# EAGLE schematic BMSV1.1 (EAGLE 9.2.2)

## Sheet 1 of 3
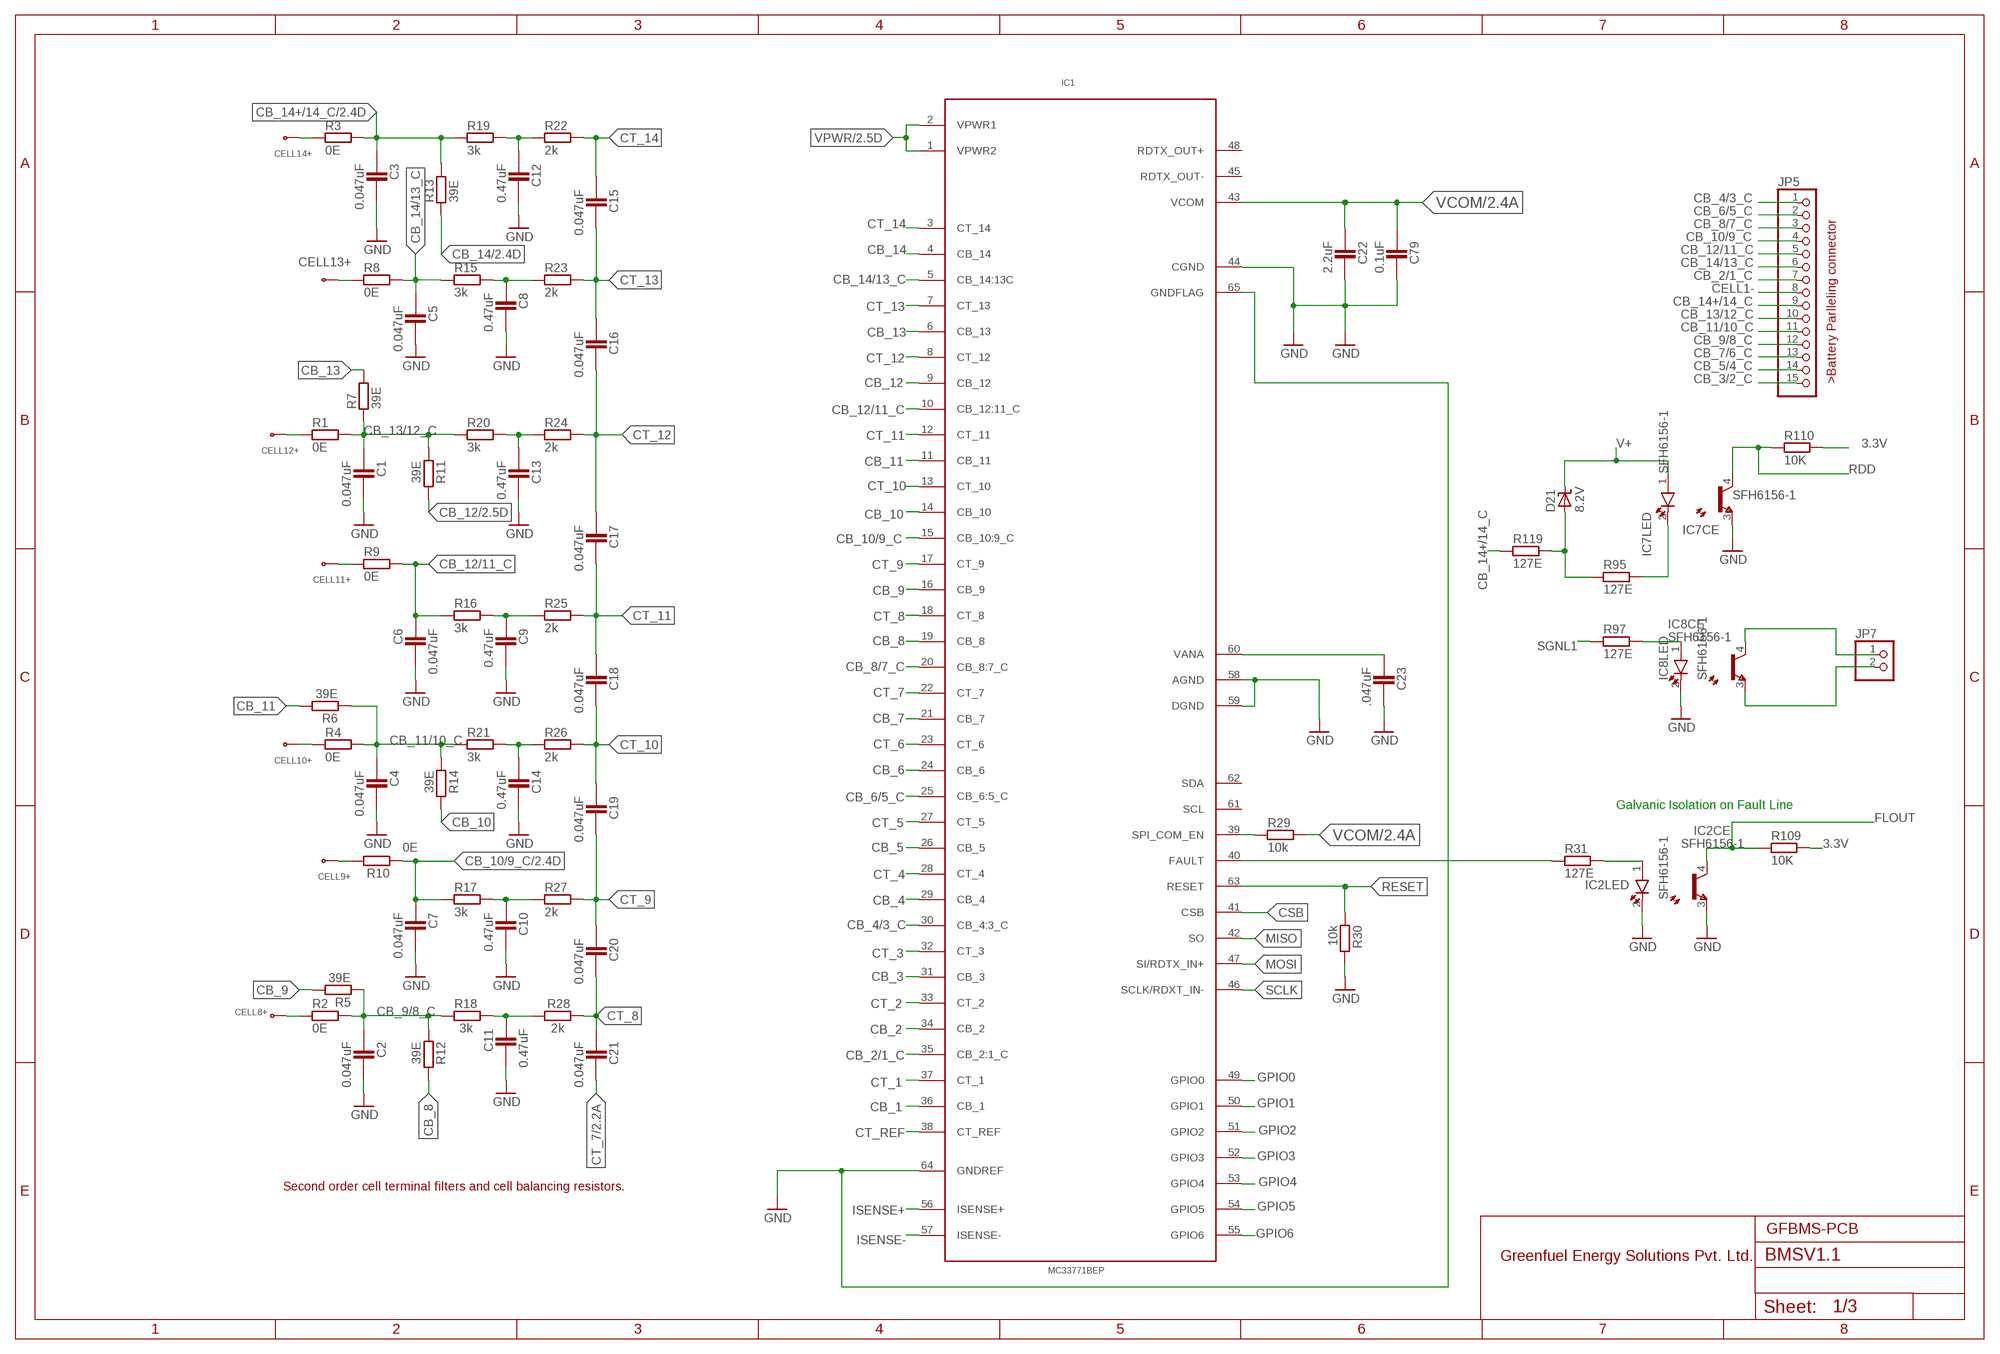
[diagram p0: schematic, sheet 1]

### Parts
C1  0.047uF  CAPACITOR_0603  [CAPC1608X92N]
C2  0.047uF  CAPACITOR_0603  [CAPC1608X92N]
C3  0.047uF  CAPACITOR_0603  [CAPC1608X92N]
C4  0.047uF  CAPACITOR_0603  [CAPC1608X92N]
C5  0.047uF  CAPACITOR_0603  [CAPC1608X92N]
C6  0.047uF  CAPACITOR_0603  [CAPC1608X92N]
C7  0.047uF  CAPACITOR_0603  [CAPC1608X92N]
C8  0.47uF  CAPACITOR_1206  [CAPC3215X168N]
C9  0.47uF  CAPACITOR_1206  [CAPC3215X168N]
C10  0.47uF  CAPACITOR_1206  [CAPC3215X168N]
C11  0.47uF  CAPACITOR_1206  [CAPC3215X168N]
C12  0.47uF  CAPACITOR_1206  [CAPC3215X168N]
C13  0.47uF  CAPACITOR_1206  [CAPC3215X168N]
C14  0.47uF  CAPACITOR_1206  [CAPC3215X168N]
C15  0.047uF  CAPACITOR_0402  [CAPC1005X60N]
C16  0.047uF  CAPACITOR_0402  [CAPC1005X60N]
C17  0.047uF  CAPACITOR_0402  [CAPC1005X60N]
C18  0.047uF  CAPACITOR_0402  [CAPC1005X60N]
C19  0.047uF  CAPACITOR_0402  [CAPC1005X60N]
C20  0.047uF  CAPACITOR_0402  [CAPC1005X60N]
C21  0.047uF  CAPACITOR_0402  [CAPC1005X60N]
C22  2.2uF  CAPACITOR_0603  [CAPC1608X92N]
C23  .047uF  CAPACITOR_0402  [CAPC1005X60N]
C79  0.1uF  CAPACITOR_0603  [CAPC1608X92N]
CELL8+  GF_BMS_CELL_PADP_PAD  [CELL_PAD]
CELL9+  GF_BMS_CELL_PADP_PAD  [CELL_PAD]
CELL10+  GF_BMS_CELL_PADP_PAD  [CELL_PAD]
CELL11+  GF_BMS_CELL_PADP_PAD  [CELL_PAD]
CELL12+  GF_BMS_CELL_PADP_PAD  [CELL_PAD]
CELL13+  GF_BMS_CELL_PADP_PAD  [CELL_PAD]
CELL14+  GF_BMS_CELL_PADP_PAD  [CELL_PAD]
D21  8.2V  ZENER_SOD-123  [SOD3718X135N]
IC1  MC33771BEP  [64PIN-LQFP]
IC2  SFH6156-1  SFH6156  [SFH]
IC7  SFH6156-1  SFH6156  [SFH]
IC8  SFH6156-1  SFH6156  [SFH]
JP5  PINHD-1X15  [1X15]
JP7  PINHD-1X2  [1X02]
R1  0E  RESISTOR_0402  [RESC1005X40AN]
R2  0E  RESISTOR_0402  [RESC1005X40AN]
R3  0E  RESISTOR_0402  [RESC1005X40AN]
R4  0E  RESISTOR_0402  [RESC1005X40AN]
R5  39E  RESISTOR_1210  [RESC3225X70N]
R6  39E  RESISTOR_1210  [RESC3225X70N]
R7  39E  RESISTOR_1210  [RESC3225X70N]
R8  0E  RESISTOR_0402  [RESC1005X40AN]
R9  0E  RESISTOR_0402  [RESC1005X40AN]
R10  0E  RESISTOR_0402  [RESC1005X40AN]
R11  39E  RESISTOR_1210  [RESC3225X70N]
R12  39E  RESISTOR_1210  [RESC3225X70N]
R13  39E  RESISTOR_1210  [RESC3225X70N]
R14  39E  RESISTOR_1210  [RESC3225X70N]
R15  3k  RESISTOR_0402  [RESC1005X40AN]
R16  3k  RESISTOR_0402  [RESC1005X40AN]
R17  3k  RESISTOR_0402  [RESC1005X40AN]
R18  3k  RESISTOR_0402  [RESC1005X40AN]
R19  3k  RESISTOR_0402  [RESC1005X40AN]
R20  3k  RESISTOR_0402  [RESC1005X40AN]
R21  3k  RESISTOR_0402  [RESC1005X40AN]
R22  2k  RESISTOR_0402  [RESC1005X40AN]
R23  2k  RESISTOR_0402  [RESC1005X40AN]
R24  2k  RESISTOR_0402  [RESC1005X40AN]
R25  2k  RESISTOR_0402  [RESC1005X40AN]
R26  2k  RESISTOR_0402  [RESC1005X40AN]
R27  2k  RESISTOR_0402  [RESC1005X40AN]
R28  2k  RESISTOR_0402  [RESC1005X40AN]
R29  10k  RESISTOR_0402  [RESC1005X40AN]
R30  10k  RESISTOR_0402  [RESC1005X40AN]
R31  127E  RESISTOR_0603  [RESC1608X55N]
R95  127E  RESISTOR_0603  [RESC1608X55N]
R97  127E  RESISTOR_0603  [RESC1608X55N]
R109  10K  RESISTOR_0402  [RESC1005X40AN]
R110  10K  RESISTOR_0402  [RESC1005X40AN]
R119  127E  RESISTOR_0603  [RESC1608X55N]

### Nets
3.3V: R109.2 R110.2 ; also sheet 3
CB_1: IC1.36(CB_1) ; also sheet 2
CB_2: IC1.34(CB_2) ; also sheet 2
CB_2/1_C: IC1.35(CB_2:1_C) JP5.7 ; also sheet 2
CB_3: IC1.31(CB_3) ; also sheet 2
CB_3/2_C: JP5.15 ; also sheet 2
CB_4: IC1.29(CB_4) ; also sheet 2
CB_4/3_C: IC1.30(CB_4:3_C) JP5.1 ; also sheet 2
CB_5: IC1.26(CB_5) ; also sheet 2
CB_5/4_C: JP5.14 ; also sheet 2
CB_6: IC1.24(CB_6) ; also sheet 2
CB_6/5_C: IC1.25(CB_6:5_C) JP5.2 ; also sheet 2
CB_7: IC1.21(CB_7) ; also sheet 2
CB_7/6_C: JP5.13 ; also sheet 2
CB_8: IC1.19(CB_8) R12.2
CB_8/7_C: IC1.20(CB_8:7_C) JP5.3 ; also sheet 2
CB_9: IC1.16(CB_9) R5.2
CB_9/8_C: C2.1 JP5.12 R2.2 R5.1 R12.1 R18.1
CB_10: IC1.14(CB_10) R14.2
CB_10/9_C: C7.1 IC1.15(CB_10:9_C) JP5.4 R10.1 R17.1 ; also sheet 2
CB_11: IC1.11(CB_11) R6.2
CB_11/10_C: C4.1 JP5.11 R4.2 R6.1 R14.1 R21.1
CB_12: IC1.9(CB_12) R11.2 ; also sheet 2
CB_12/11_C: C6.1 IC1.10(CB_12:11_C) JP5.5 R9.2 R16.1
CB_13: IC1.6(CB_13) R7.2
CB_13/12_C: C1.1 JP5.10 R1.2 R7.1 R11.1 R20.1
CB_14: IC1.4(CB_14) R13.1 ; also sheet 2
CB_14+/14_C: C3.1 JP5.9 R3.2 R13.2 R19.1 R119.1 ; also sheet 2
CB_14/13_C: C5.1 IC1.5(CB_14:13C) JP5.6 R8.2 R15.1
CELL1-: JP5.8 ; also sheet 2
CELL8+: CELL8+.P$1(S) R2.1
CELL9+: CELL9+.P$1(S) R10.2
CELL10+: CELL10+.P$1(S) R4.1
CELL11+: CELL11+.P$1(S) R9.1
CELL12+: CELL12+.P$1(S) R1.1
CELL13+: CELL13+.P$1(S) R8.1
CELL14+: CELL14+.P$1(S) R3.1 ; also sheet 2
CSB: IC1.41(CSB) ; also sheet 3
CT_1: IC1.37(CT_1) ; also sheet 2
CT_2: IC1.33(CT_2) ; also sheet 2
CT_3: IC1.32(CT_3) ; also sheet 2
CT_4: IC1.28(CT_4) ; also sheet 2
CT_5: IC1.27(CT_5) ; also sheet 2
CT_6: IC1.23(CT_6) ; also sheet 2
CT_7: C21.2 IC1.22(CT_7) ; also sheet 2
CT_8: C20.2 C21.1 IC1.18(CT_8) R28.2
CT_9: C19.2 C20.1 IC1.17(CT_9) R27.2
CT_10: C18.2 C19.1 IC1.13(CT_10) R26.2
CT_11: C17.2 C18.1 IC1.12(CT_11) R25.2
CT_12: C16.2 C17.1 IC1.8(CT_12) R24.2
CT_13: C15.2 C16.1 IC1.7(CT_13) R23.2
CT_14: C15.1 IC1.3(CT_14) R22.2
CT_REF: IC1.38(CT_REF) ; also sheet 2
FLOUT: IC2.4(CE:C) R109.1 ; also sheet 3
GND: C1.2 C2.2 C3.2 C4.2 C5.2 C6.2 C7.2 C8.2 C9.2 C10.2 C11.2 C12.2 C13.2 C14.2 C22.2 C23.2 C79.2 IC1.44(CGND) IC1.58(AGND) IC1.59(DGND) IC1.64(GNDREF) IC1.65(GNDFLAG) IC2.2(LED:K) IC2.3(CE:E) IC7.3(CE:E) IC8.2(LED:K) R30.2 ; also sheet 2,3
GPIO0: IC1.49(GPIO0) ; also sheet 2
GPIO1: IC1.50(GPIO1) ; also sheet 2
GPIO2: IC1.51(GPIO2) ; also sheet 2
GPIO3: IC1.52(GPIO3) ; also sheet 2
GPIO4: IC1.53(GPIO4) ; also sheet 2
GPIO5: IC1.54(GPIO5) ; also sheet 2
GPIO6: IC1.55(GPIO6) ; also sheet 2
ISENSE+: IC1.56(ISENSE+) ; also sheet 2
ISENSE-: IC1.57(ISENSE-) ; also sheet 2
MISO: IC1.42(SO) ; also sheet 3
MOSI: IC1.47(SI/RDTX_IN+) ; also sheet 3
N$1: C12.1 R19.2 R22.1
N$2: C11.1 R18.2 R28.1
N$4: C14.1 R21.2 R26.1
N$5: C13.1 R20.2 R24.1
N$6: C8.1 R15.2 R23.1
N$7: C10.1 R17.2 R27.1
N$9: C9.1 R16.2 R25.1
N$14: IC8.4(CE:C) JP7.1
N$15: IC8.3(CE:E) JP7.2
N$25: IC7.2(LED:K) R95.2
N$27: IC8.1(LED:A) R97.2
N$30: IC1.40(FAULT) R31.1
N$31: IC2.1(LED:A) R31.2
N$34: IC1.39(SPI_COM_EN) R29.1
N$36: D21.A R95.1 R119.2
RDD: IC7.4(CE:C) R110.1 ; also sheet 3
RESET: IC1.63(RESET) R30.1
SCLK: IC1.46(SCLK/RDXT_IN-) ; also sheet 3
SGNL1: R97.1 ; also sheet 3
V+: D21.K IC7.1(LED:A) ; also sheet 3
VANA: C23.1 IC1.60(VANA)
VCOM: C22.1 C79.1 IC1.43(VCOM) R29.2 ; also sheet 2
VPWR: IC1.1(VPWR2) IC1.2(VPWR1) ; also sheet 2
Unconnected: IC1.45(RDTX_OUT-) IC1.48(RDTX_OUT+) IC1.61(SCL) IC1.62(SDA)

### Notes on the sheet
- >Battery Parlleling connector
- Galvanic Isolation on Fault Line
- Second order cell terminal filters and cell balancing resistors.
- GFBMS-PCB
- Greenfuel Energy Solutions Pvt. Ltd.

## Sheet 2 of 3
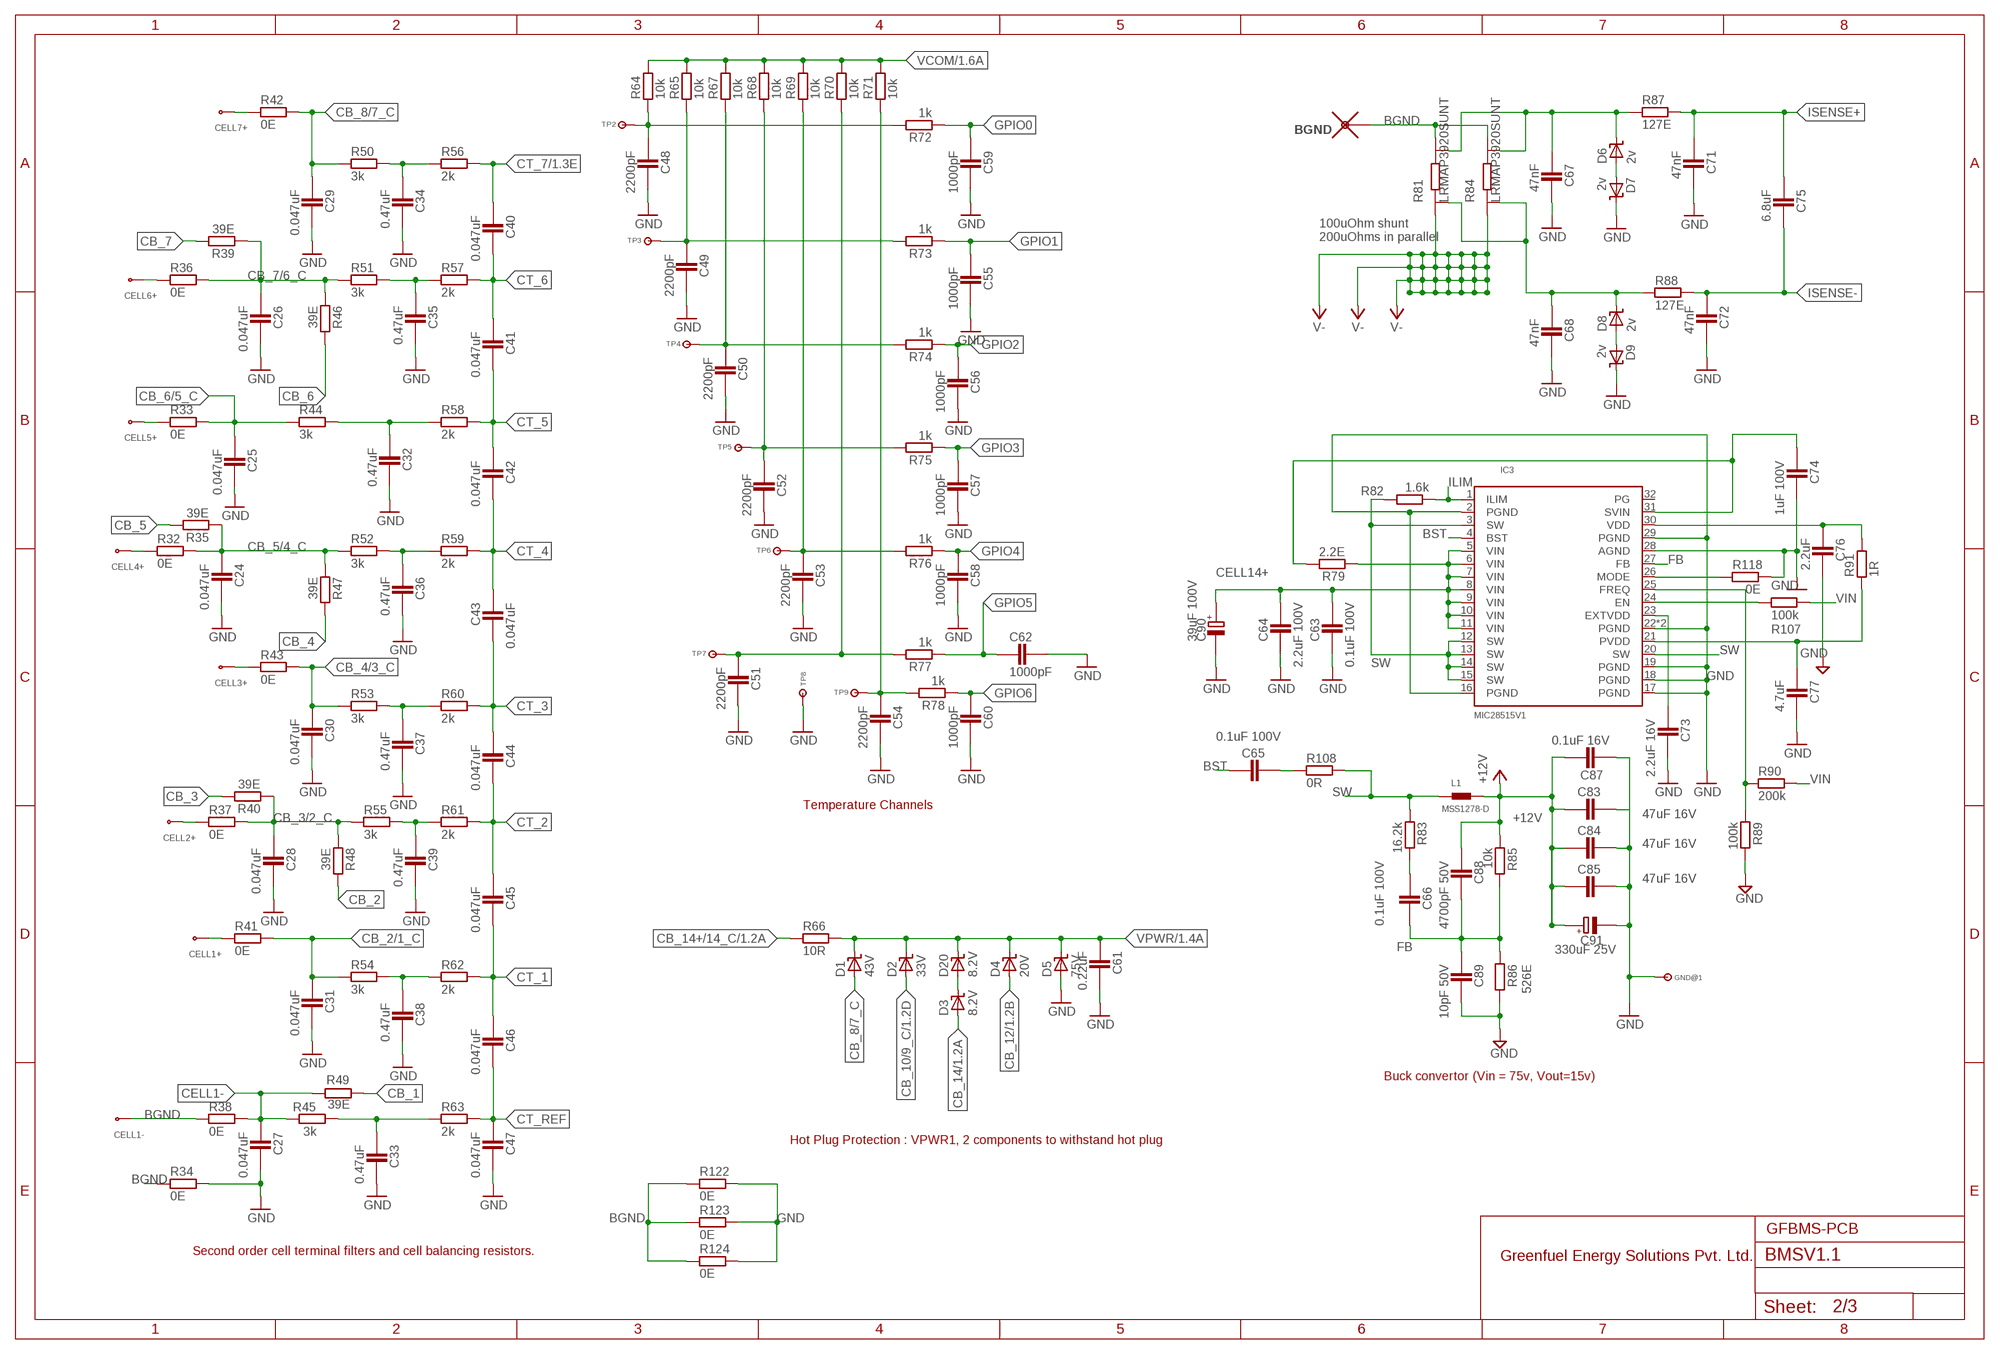
[diagram p1: schematic, sheet 2]

### Parts
BGND  WPAD  [WPAD]
C24  0.047uF  CAPACITOR_0603  [CAPC1608X92N]
C25  0.047uF  CAPACITOR_0603  [CAPC1608X92N]
C26  0.047uF  CAPACITOR_0603  [CAPC1608X92N]
C27  0.047uF  CAPACITOR_0603  [CAPC1608X92N]
C28  0.047uF  CAPACITOR_0603  [CAPC1608X92N]
C29  0.047uF  CAPACITOR_0603  [CAPC1608X92N]
C30  0.047uF  CAPACITOR_0603  [CAPC1608X92N]
C31  0.047uF  CAPACITOR_0603  [CAPC1608X92N]
C32  0.47uF  CAPACITOR_1206  [CAPC3215X168N]
C33  0.47uF  CAPACITOR_1206  [CAPC3215X168N]
C34  0.47uF  CAPACITOR_1206  [CAPC3215X168N]
C35  0.47uF  CAPACITOR_1206  [CAPC3215X168N]
C36  0.47uF  CAPACITOR_1206  [CAPC3215X168N]
C37  0.47uF  CAPACITOR_1206  [CAPC3215X168N]
C38  0.47uF  CAPACITOR_1206  [CAPC3215X168N]
C39  0.47uF  CAPACITOR_1206  [CAPC3215X168N]
C40  0.047uF  CAPACITOR_0402  [CAPC1005X60N]
C41  0.047uF  CAPACITOR_0402  [CAPC1005X60N]
C42  0.047uF  CAPACITOR_0402  [CAPC1005X60N]
C43  0.047uF  CAPACITOR_0402  [CAPC1005X60N]
C44  0.047uF  CAPACITOR_0402  [CAPC1005X60N]
C45  0.047uF  CAPACITOR_0402  [CAPC1005X60N]
C46  0.047uF  CAPACITOR_0402  [CAPC1005X60N]
C47  0.047uF  CAPACITOR_0402  [CAPC1005X60N]
C48  2200pF  CAPACITOR_0402  [CAPC1005X60N]
C49  2200pF  CAPACITOR_0402  [CAPC1005X60N]
C50  2200pF  CAPACITOR_0402  [CAPC1005X60N]
C51  2200pF  CAPACITOR_0402  [CAPC1005X60N]
C52  2200pF  CAPACITOR_0402  [CAPC1005X60N]
C53  2200pF  CAPACITOR_0402  [CAPC1005X60N]
C54  2200pF  CAPACITOR_0402  [CAPC1005X60N]
C55  1000pF  CAPACITOR_0402  [CAPC1005X60N]
C56  1000pF  CAPACITOR_0402  [CAPC1005X60N]
C57  1000pF  CAPACITOR_0402  [CAPC1005X60N]
C58  1000pF  CAPACITOR_0402  [CAPC1005X60N]
C59  1000pF  CAPACITOR_0402  [CAPC1005X60N]
C60  1000pF  CAPACITOR_0402  [CAPC1005X60N]
C61  0.22uF  CAPACITOR_0805  [CAPC2012X145AN]
C62  1000pF  CAPACITOR_0402  [CAPC1005X60N]
C63  0.1uF 100V  CAPACITOR_0603  [CAPC1608X92N]
C64  2.2uF 100V  CAPACITOR_1210  [CAPC3225X168N]
C65  0.1uF 100V  CAPACITOR_0603  [CAPC1608X92N]
C66  0.1uF 100V  CAPACITOR_0603  [CAPC1608X92N]
C67  47nF  CAPACITOR_0603  [CAPC1608X92N]
C68  47nF  CAPACITOR_0603  [CAPC1608X92N]
C71  47nF  CAPACITOR_0402  [CAPC1005X60N]
C72  47nF  CAPACITOR_0402  [CAPC1005X60N]
C73  2.2uF 16V  CAPACITOR_0603  [CAPC1608X92N]
C74  1uF 100V  CAPACITOR_0805  [CAPC2012X145AN]
C75  6.8uF  CAPACITOR_0805  [CAPC2012X145AN]
C76  2.2uF  CAPACITOR_0603  [CAPC1608X92N]
C77  4.7uF  CAPACITOR_0805  [CAPC2012X145AN]
C83  47uF 16V  CAPACITOR_1210  [CAPC3225X168N]
C84  47uF 16V  CAPACITOR_1210  [CAPC3225X168N]
C85  47uF 16V  CAPACITOR_1210  [CAPC3225X168N]
C87  0.1uF 16V  CAPACITOR_0603  [CAPC1608X92N]
C88  4700pF 50V  CAPACITOR_0603  [CAPC1608X92N]
C89  10pF 50V  CAPACITOR_0603  [CAPC1608X92N]
C90  39uF 100V  POLARISED_CASE_F  [CAPAE830X1020N]
C91  330uF 25V  POLARISED_CASE_F  [CAPAE830X1020N]
CELL1+  GF_BMS_CELL_PADP_PAD  [CELL_PAD]
CELL1-  GF_BMS_CELL_PADP_PAD  [CELL_PAD]
CELL2+  GF_BMS_CELL_PADP_PAD  [CELL_PAD]
CELL3+  GF_BMS_CELL_PADP_PAD  [CELL_PAD]
CELL4+  GF_BMS_CELL_PADP_PAD  [CELL_PAD]
CELL5+  GF_BMS_CELL_PADP_PAD  [CELL_PAD]
CELL6+  GF_BMS_CELL_PADP_PAD  [CELL_PAD]
CELL7+  GF_BMS_CELL_PADP_PAD  [CELL_PAD]
D1  43V  ZENER_SOD-323  [SOD2514X100N]
D2  33V  ZENER_SOD-123  [SOD3718X135N]
D3  8.2V  ZENER_SOD-123  [SOD3718X135N]
D4  20V  ZENER_SOD-123  [SOD3718X135N]
D5  75V  ZENER_SOD-123  [SOD3718X135N]
D6  2v  ZENER_SOD-123  [SOD3718X135N]
D7  2v  ZENER_SOD-123  [SOD3718X135N]
D8  2v  ZENER_SOD-123  [SOD3718X135N]
D9  2v  ZENER_SOD-123  [SOD3718X135N]
D20  8.2V  ZENER_SOD-123  [SOD3718X135N]
GND@1  TP-SMD60  [TP-SMD60]
IC3  MIC28515V1  [VQFN-32]
L1  MSS1278-D  [MSS1278D/T]
R32  0E  RESISTOR_0402  [RESC1005X40AN]
R33  0E  RESISTOR_0402  [RESC1005X40AN]
R34  0E  RESISTOR_0402  [RESC1005X40AN]
R35  39E  RESISTOR_1210  [RESC3225X70N]
R36  0E  RESISTOR_0402  [RESC1005X40AN]
R37  0E  RESISTOR_0402  [RESC1005X40AN]
R38  0E  RESISTOR_0402  [RESC1005X40AN]
R39  39E  RESISTOR_1210  [RESC3225X70N]
R40  39E  RESISTOR_1210  [RESC3225X70N]
R41  0E  RESISTOR_0402  [RESC1005X40AN]
R42  0E  RESISTOR_0402  [RESC1005X40AN]
R43  0E  RESISTOR_0402  [RESC1005X40AN]
R44  3k  RESISTOR_0402  [RESC1005X40AN]
R45  3k  RESISTOR_0402  [RESC1005X40AN]
R46  39E  RESISTOR_1210  [RESC3225X70N]
R47  39E  RESISTOR_1210  [RESC3225X70N]
R48  39E  RESISTOR_1210  [RESC3225X70N]
R49  39E  RESISTOR_1210  [RESC3225X70N]
R50  3k  RESISTOR_0402  [RESC1005X40AN]
R51  3k  RESISTOR_0402  [RESC1005X40AN]
R52  3k  RESISTOR_0402  [RESC1005X40AN]
R53  3k  RESISTOR_0402  [RESC1005X40AN]
R54  3k  RESISTOR_0402  [RESC1005X40AN]
R55  3k  RESISTOR_0402  [RESC1005X40AN]
R56  2k  RESISTOR_0402  [RESC1005X40AN]
R57  2k  RESISTOR_0402  [RESC1005X40AN]
R58  2k  RESISTOR_0402  [RESC1005X40AN]
R59  2k  RESISTOR_0402  [RESC1005X40AN]
R60  2k  RESISTOR_0402  [RESC1005X40AN]
R61  2k  RESISTOR_0402  [RESC1005X40AN]
R62  2k  RESISTOR_0402  [RESC1005X40AN]
R63  2k  RESISTOR_0402  [RESC1005X40AN]
R64  10k  RESISTOR_0402  [RESC1005X40AN]
R65  10k  RESISTOR_0402  [RESC1005X40AN]
R66  10R  RESISTOR_0603  [RESC1608X55N]
R67  10k  RESISTOR_0402  [RESC1005X40AN]
R68  10k  RESISTOR_0402  [RESC1005X40AN]
R69  10k  RESISTOR_0402  [RESC1005X40AN]
R70  10k  RESISTOR_0402  [RESC1005X40AN]
R71  10k  RESISTOR_0402  [RESC1005X40AN]
R72  1k  RESISTOR_0402  [RESC1005X40AN]
R73  1k  RESISTOR_0402  [RESC1005X40AN]
R74  1k  RESISTOR_0402  [RESC1005X40AN]
R75  1k  RESISTOR_0402  [RESC1005X40AN]
R76  1k  RESISTOR_0402  [RESC1005X40AN]
R77  1k  RESISTOR_0402  [RESC1005X40AN]
R78  1k  RESISTOR_0402  [RESC1005X40AN]
R79  2.2E  RESISTOR_0603  [RESC1608X55N]
R81  LRMAP3920SUNT  [SMD4]
R82  1.6k  RESISTOR_0603  [RESC1608X55N]
R83  16.2k  RESISTOR_0603  [RESC1608X55N]
R84  LRMAP3920SUNT  [SMD4]
R85  10k  RESISTOR_0603  [RESC1608X55N]
R86  526E  RESISTOR_0603  [RESC1608X55N]
R87  127E  RESISTOR_0603  [RESC1608X55N]
R88  127E  RESISTOR_0603  [RESC1608X55N]
R89  100k  RESISTOR_0603  [RESC1608X55N]
R90  200k  RESISTOR_0603  [RESC1608X55N]
R91  1R  RESISTOR_0603  [RESC1608X55N]
R107  100k  RESISTOR_0603  [RESC1608X55N]
R108  0R  RESISTOR_0402  [RESC1005X40AN]
R118  0E  RESISTOR_0402  [RESC1005X40AN]
R122  0E  RESISTOR_0402  [RESC1005X40AN]
R123  0E  RESISTOR_0402  [RESC1005X40AN]
R124  0E  RESISTOR_0402  [RESC1005X40AN]
TP2  TPTH7035  [TP7035]
TP3  TPTH7035  [TP7035]
TP4  TPTH7035  [TP7035]
TP5  TPTH7035  [TP7035]
TP6  TPTH7035  [TP7035]
TP7  TPTH7035  [TP7035]
TP8  TPTH7035  [TP7035]
TP9  TPTH7035  [TP7035]

### Nets
+12V: C83.1 C84.1 C85.1 C87.2 C88.1 C91.+ L1.2 R85.1 ; also sheet 3
BGND: BGND.1 CELL1-.P$1(S) R34.1 R38.1 R81.4 R81.6 R84.4 R84.6 R122.1 R123.1 R124.1 ; also sheet 3
BST: C65.1 IC3.4(BST)
CB_1: R49.2 ; also sheet 1
CB_2: R48.2 ; also sheet 1
CB_2/1_C: C31.1 R41.2 R54.1 ; also sheet 1
CB_3: R40.2 ; also sheet 1
CB_3/2_C: C28.1 R37.2 R40.1 R48.1 R55.1 ; also sheet 1
CB_4: R47.2 ; also sheet 1
CB_4/3_C: C30.1 R43.2 R53.1 ; also sheet 1
CB_5: R35.2 ; also sheet 1
CB_5/4_C: C24.1 R32.2 R35.1 R47.1 R52.1 ; also sheet 1
CB_6: R46.2 ; also sheet 1
CB_6/5_C: C25.1 R33.2 R44.1 ; also sheet 1
CB_7: R39.2 ; also sheet 1
CB_7/6_C: C26.1 R36.2 R39.1 R46.1 R51.1 ; also sheet 1
CB_8/7_C: C29.1 D1.A R42.2 R50.1 ; also sheet 1
CB_10/9_C: D2.A ; also sheet 1
CB_12: D4.A ; also sheet 1
CB_14: D3.A ; also sheet 1
CB_14+/14_C: R66.1 ; also sheet 1
CELL1+: CELL1+.P$1(S) R41.1
CELL1-: C27.1 R38.2 R45.1 R49.1 ; also sheet 1
CELL2+: CELL2+.P$1(S) R37.1
CELL3+: CELL3+.P$1(S) R43.1
CELL4+: CELL4+.P$1(S) R32.1
CELL5+: CELL5+.P$1(S) R33.1
CELL6+: CELL6+.P$1(S) R36.1
CELL7+: CELL7+.P$1(S) R42.1
CELL14+: C63.2 C64.2 C90.+ IC3.5(VIN) IC3.6(VIN) IC3.7(VIN) IC3.8(VIN) IC3.9(VIN) IC3.10(VIN) IC3.11(VIN) R79.1 ; also sheet 1
CT_1: C45.2 C46.1 R62.2 ; also sheet 1
CT_2: C44.2 C45.1 R61.2 ; also sheet 1
CT_3: C43.2 C44.1 R60.2 ; also sheet 1
CT_4: C42.2 C43.1 R59.2 ; also sheet 1
CT_5: C41.2 C42.1 R58.2 ; also sheet 1
CT_6: C40.2 C41.1 R57.2 ; also sheet 1
CT_7: C40.1 R56.2 ; also sheet 1
CT_REF: C46.2 C47.1 R63.2 ; also sheet 1
FB: C66.2 C88.2 C89.1 IC3.27(FB) R85.2 R86.1
GND: C24.2 C25.2 C26.2 C27.2 C28.2 C29.2 C30.2 C31.2 C32.2 C33.2 C34.2 C35.2 C36.2 C37.2 C38.2 C39.2 C47.2 C48.2 C49.2 C50.2 C51.2 C52.2 C53.2 C54.2 C55.2 C56.2 C57.2 C58.2 C59.2 C60.2 C61.2 C62.2 C63.1 C64.1 C67.2 C68.2 C71.2 C72.2 C73.2 C74.2 C76.2 C77.2 C83.2 C84.2 C85.2 C87.1 C89.2 C90.- C91.- D5.A D7.K D9.K GND@1.P$1 IC3.2(PGND) IC3.16(PGND) IC3.17(PGND) IC3.18(PGND) IC3.19(PGND) IC3.22(PGND) IC3.28(AGND) IC3.29(PGND) IC3.33(PGND) R34.2 R86.2 R89.2 R118.2 R122.2 R123.2 R124.2 TP8.P$1 ; also sheet 1,3
GPIO0: C59.1 R72.1 ; also sheet 1
GPIO1: C55.1 R73.1 ; also sheet 1
GPIO2: C56.1 R74.1 ; also sheet 1
GPIO3: C57.1 R75.1 ; also sheet 1
GPIO4: C58.1 R76.1 ; also sheet 1
GPIO5: C62.1 R77.1 ; also sheet 1
GPIO6: C60.1 R78.1 ; also sheet 1
ILIM: IC3.1(ILIM) R82.1
ISENSE+: C71.1 C75.1 R87.2 ; also sheet 1
ISENSE-: C72.1 C75.2 R88.2 ; also sheet 1
N$3: D8.A D9.A
N$8: C32.1 R44.2 R58.1
N$10: C38.1 R54.2 R62.1
N$11: D6.A D7.A
N$12: IC3.24(EN) R107.1
N$13: C65.2 R108.1
N$16: C37.1 R53.2 R60.1
N$17: IC3.25(FREQ) R89.1 R90.1
N$18: C73.1 IC3.23(EXTVDD)
N$21: C74.1 IC3.31(SVIN) R79.2
N$23: C36.1 R52.2 R59.1
N$24: C66.1 R83.2
N$26: D3.K D20.A
N$38: C35.1 R51.2 R57.1
N$41: C34.1 R50.2 R56.1
N$46: C39.1 R55.2 R61.1
N$48: C33.1 R45.2 R63.1
N$49: C48.1 R64.1 R72.2 TP2.P$1
N$50: C49.1 R65.1 R73.2 TP3.P$1
N$51: C50.1 R67.1 R74.2 TP4.P$1
N$52: C52.1 R68.1 R75.2 TP5.P$1
N$53: C53.1 R69.1 R76.2 TP6.P$1
N$54: C51.1 R70.1 R77.2 TP7.P$1
N$55: C54.1 R71.1 R78.2 TP9.P$1
N$61: IC3.26(MODE) R118.1
N$68: C67.1 D6.K R81.5 R84.5 R87.1
N$70: C68.1 D8.K R81.2 R84.2 R88.1
PVDD: C77.1 IC3.21(PVDD) R91.1
SW: IC3.3(SW) IC3.12(SW) IC3.13(SW) IC3.14(SW) IC3.15(SW) IC3.20(SW) L1.1 R82.2 R83.1 R108.2
V-: R81.1 R81.3 R84.1 R84.3 ; also sheet 3
VCOM: R64.2 R65.2 R67.2 R68.2 R69.2 R70.2 R71.2 ; also sheet 1
VDD: C76.1 IC3.30(VDD) R91.2
VIN: R90.2 R107.2
VPWR: C61.1 D1.K D2.K D4.K D5.K D20.K R66.2 ; also sheet 1
Unconnected: IC3.32(PG)

### Notes on the sheet
- 100uOhm shunt 
  200uOhms in parallel
- current channel filter
- Temperature Channels
- Buck convertor (Vin = 75v, Vout=15v)
- Hot Plug Protection : VPWR1, 2 components to withstand hot plug
- GFBMS-PCB
- Second order cell terminal filters and cell balancing resistors.
- Greenfuel Energy Solutions Pvt. Ltd.

## Sheet 3 of 3
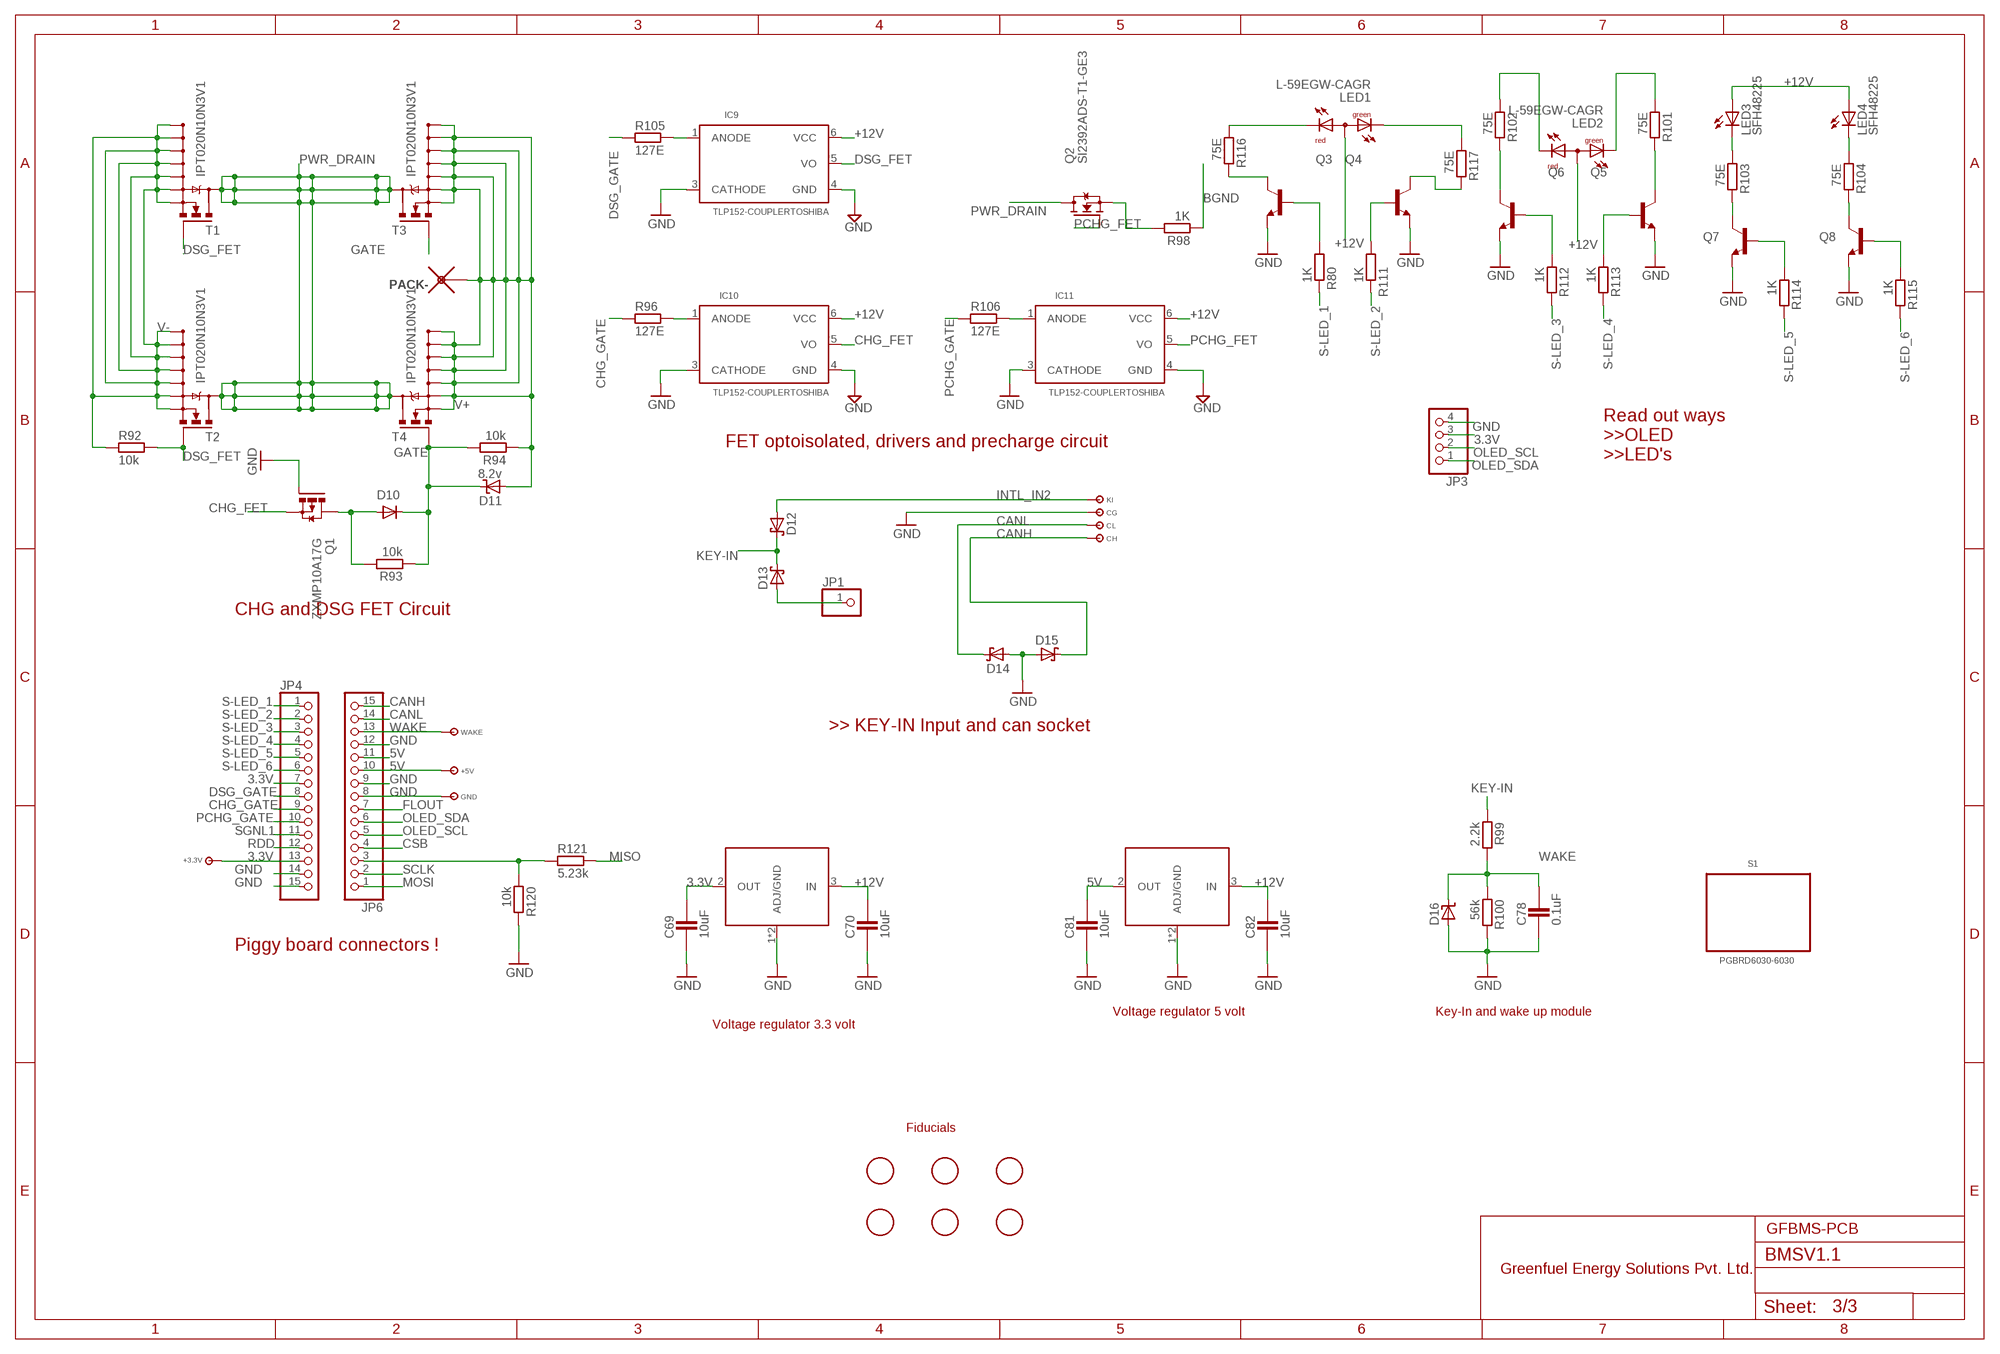
[diagram p2: schematic, sheet 3]

### Parts
+3.3V  TP-SMD60  [TP-SMD60]
+5V  TP-SMD60  [TP-SMD60]
C69  10uF  CAPACITOR_0805  [CAPC2012X145AN]
C70  10uF  CAPACITOR_0805  [CAPC2012X145AN]
C78  0.1uF  CAPACITOR_0603  [CAPC1608X92N]
C81  10uF  CAPACITOR_0805  [CAPC2012X145AN]
C82  10uF  CAPACITOR_0805  [CAPC2012X145AN]
CG  TPTH7035  [TP7035]
CH  TPTH7035  [TP7035]
CL  TPTH7035  [TP7035]
D10  DIODE_SOD-123  [SOD3718X135N]
D11  8.2v  ZENER_SOD-123  [SOD3718X135N]
D12  SCHOTTKY_SOD-123  [SOD3718X135N]
D13  SCHOTTKY_SOD-123  [SOD3718X135N]
D14  SCHOTTKY_SOD-123  [SOD3718X135N]
D15  SCHOTTKY_SOD-123  [SOD3718X135N]
D16  ZENER_SOD-323  [SOD2514X100N]
FD1  FIDUCIAL  [FIDUCIAL_1MM]
FD2  FIDUCIAL  [FIDUCIAL_1MM]
FD3  FIDUCIAL  [FIDUCIAL_1MM]
FD4  FIDUCIAL  [FIDUCIAL_1MM]
FD5  FIDUCIAL  [FIDUCIAL_1MM]
FD6  FIDUCIAL  [FIDUCIAL_1MM]
GND  TP-SMD60  [TP-SMD60]
IC9  TLP152-COUPLERTOSHIBA  [SO6-5PIN]
IC10  TLP152-COUPLERTOSHIBA  [SO6-5PIN]
IC11  TLP152-COUPLERTOSHIBA  [SO6-5PIN]
JP1  PINHD-1X1CB  [1X01-CLEANBIG]
JP3  PINOLED-4  [OLED-CON]
JP4  PINHD-1X15  [1X15]
JP6  PINHD-1X15  [1X15]
KI  TPTH7035  [TP7035]
LED1  L-59EGW-CAGR  [L-59EGW-CA]
LED2  L-59EGW-CAGR  [L-59EGW-CA]
LED3  SFH48225  [SFH482]
LED4  SFH48225  [SFH482]
PACK-  WPAD  [WPAD]
Q1  ZXMP10A17G  [SOT23-3]
Q2  SI2392ADS-T1-GE3  BSS138  [SOT23-3]
Q3  NPN_SOT-23  [SOT95P280X135-3N]
Q4  NPN_SOT-23  [SOT95P280X135-3N]
Q5  NPN_SOT-23  [SOT95P280X135-3N]
Q6  NPN_SOT-23  [SOT95P280X135-3N]
Q7  NPN_SOT-23  [SOT95P280X135-3N]
Q8  NPN_SOT-23  [SOT95P280X135-3N]
R80  1K  RESISTOR_0402  [RESC1005X40AN]
R92  10k  RESISTOR_0402  [RESC1005X40AN]
R93  10k  RESISTOR_0402  [RESC1005X40AN]
R94  10k  RESISTOR_0402  [RESC1005X40AN]
R96  127E  RESISTOR_0603  [RESC1608X55N]
R98  1K  RESISTOR_2010  [RESC5025X70N]
R99  2.2k  RESISTOR_0603  [RESC1608X55N]
R100  56k  RESISTOR_0603  [RESC1608X55N]
R101  75E  RESISTOR_0402  [RESC1005X40AN]
R102  75E  RESISTOR_0402  [RESC1005X40AN]
R103  75E  RESISTOR_0402  [RESC1005X40AN]
R104  75E  RESISTOR_0402  [RESC1005X40AN]
R105  127E  RESISTOR_0603  [RESC1608X55N]
R106  127E  RESISTOR_0603  [RESC1608X55N]
R111  1K  RESISTOR_0402  [RESC1005X40AN]
R112  1K  RESISTOR_0402  [RESC1005X40AN]
R113  1K  RESISTOR_0402  [RESC1005X40AN]
R114  1K  RESISTOR_0402  [RESC1005X40AN]
R115  1K  RESISTOR_0402  [RESC1005X40AN]
R116  75E  RESISTOR_0402  [RESC1005X40AN]
R117  75E  RESISTOR_0402  [RESC1005X40AN]
R120  10k  RESISTOR_0603  [RESC1608X55N]
R121  5.23k  RESISTOR_0603  [RESC1608X55N]
S1  PGBRD6030-6030  [PIG6030]
T1  IPT020N10N3V1  [PG-HSOF-9]
T2  IPT020N10N3V1  [PG-HSOF-9]
T3  IPT020N10N3V1  [PG-HSOF-9]
T4  IPT020N10N3V1  [PG-HSOF-9]
U1  NCV1117ST33T3G  NCP1117LP-PG  [SOT-223]
U2  NCV1117ST50T3G  NCP1117LP-PG  [SOT-223]
WAKE  TP-SMD60  [TP-SMD60]

### Nets
3.3V: +3.3V.P$1 C69.2 JP3.3 JP4.7 JP4.13 U1.2(OUT) ; also sheet 1
5V: +5V.P$1 C81.2 JP6.10 JP6.11 U2.2(OUT)
+12V: C70.2 C82.2 IC9.6(VCC) IC10.6(VCC) IC11.6(VCC) LED1.2(A) LED2.2(A) LED3.A LED4.A U1.3(IN) U2.3(IN) ; also sheet 2
BGND: R98.1 ; also sheet 2
CANH: CH.P$1 D15.K JP6.15
CANL: CL.P$1 D14.K JP6.14
CHG_FET: IC10.5(VO) Q1.2(S)
CHG_GATE: JP4.9 R96.1
CSB: JP6.4 ; also sheet 1
DSG_FET: IC9.5(VO) R92.2 T1.1(G) T2.1(G)
DSG_GATE: JP4.8 R105.1
FLOUT: JP6.7 ; also sheet 1
GATE: D10.K D11.K R93.1 R94.2 T3.1(G) T4.1(G)
GND: C69.1 C70.1 C78.1 C81.1 C82.1 CG.P$1 D14.A D15.A D16.A GND.P$1 IC9.3(CATHODE) IC9.4(GND) IC10.3(CATHODE) IC10.4(GND) IC11.3(CATHODE) IC11.4(GND) JP3.4 JP4.14 JP4.15 JP6.8 JP6.9 JP6.12 Q1.1(G) Q3.2(E) Q4.2(E) Q5.2(E) Q6.2(E) Q7.2(E) Q8.2(E) R100.2 R120.2 U1.1(ADJ/GND) U1.4(ADJ/GND) U2.1(ADJ/GND) U2.4(ADJ/GND) ; also sheet 1,2
INTL_IN2: D12.A KI.P$1
KEY-IN: D12.K D13.K R99.1
MISO: R121.2 ; also sheet 1
MOSI: JP6.1 ; also sheet 1
N$19: D10.A Q1.3(D) R93.2
N$20: IC9.1(ANODE) R105.2
N$22: Q7.3(C) R103.2
N$28: Q2.2(S) R98.2
N$29: Q8.3(C) R104.2
N$32: Q3.1(B) R80.1
N$33: IC10.1(ANODE) R96.2
N$35: IC11.1(ANODE) R106.2
N$37: Q4.1(B) R111.1
N$39: Q6.1(B) R112.1
N$40: Q5.1(B) R113.1
N$42: Q7.1(B) R114.1
N$43: Q8.1(B) R115.1
N$44: LED1.3(CR) R116.1
N$45: Q3.3(C) R116.2
N$47: LED1.1(CG) R117.1
N$56: Q6.3(C) R102.2
N$57: Q5.3(C) R101.2
N$58: Q4.3(C) R117.2
N$59: LED2.3(CR) R102.1
N$60: LED2.1(CG) R101.1
N$62: JP6.3 R120.1 R121.1
N$72: LED4.K(C) R104.1
N$73: LED3.K(C) R103.1
N$78: D13.A JP1.1
OLED_SCL: JP3.2 JP6.5
OLED_SDA: JP3.1 JP6.6
PCHG_FET: IC11.5(VO) Q2.1(G)
PCHG_GATE: JP4.10 R106.1
PWR_DRAIN: Q2.3(D) T1.9(D) T2.9(D) T3.9(D) T4.9(D)
RDD: JP4.12 ; also sheet 1
S-LED_1: JP4.1 R80.2
S-LED_2: JP4.2 R111.2
S-LED_3: JP4.3 R112.2
S-LED_4: JP4.4 R113.2
S-LED_5: JP4.5 R114.2
S-LED_6: JP4.6 R115.2
SCLK: JP6.2 ; also sheet 1
SGNL1: JP4.11 ; also sheet 1
V+: D11.A PACK-.1 R94.1 T3.2(S) T3.3(S1) T3.4(S2) T3.5(S3) T3.6(S4) T3.7(S5) T3.8(S6) T4.2(S) T4.3(S1) T4.4(S2) T4.5(S3) T4.6(S4) T4.7(S5) T4.8(S6) ; also sheet 1
V-: R92.1 T1.2(S) T1.3(S1) T1.4(S2) T1.5(S3) T1.6(S4) T1.7(S5) T1.8(S6) T2.2(S) T2.3(S1) T2.4(S2) T2.5(S3) T2.6(S4) T2.7(S5) T2.8(S6) ; also sheet 2
WAKE: C78.2 D16.K JP6.13 R99.2 R100.1 WAKE.P$1

### Notes on the sheet
- FET optoisolated, drivers and precharge circuit
- Read out ways
  >>OLED
  >>LED's
- CHG and DSG FET Circuit
- >> KEY-IN Input and can socket
- Piggy board connectors !
- Voltage regulator 5 volt | Key-In and wake up module
- Voltage regulator 3.3 volt
- Fiducials
- GFBMS-PCB
- Greenfuel Energy Solutions Pvt. Ltd.

## Library data of the parts
+3.3V +5V CG CH CL GND GND@1 KI TP2-TP9 WAKE = simpa:TP
BGND PACK- = simpa:WPAD
C1-C79 C81-C85 C87-C89 = ipc-7351-capacitor:CAPACITOR_
C90 C91 = ipc-7351-capacitor:POLARISED_
CELL1+ CELL1- CELL2+ CELL3+ CELL4+ CELL5+ CELL6+ CELL7+ CELL8+ CELL9+ CELL10+ CELL11+ CELL12+ CELL13+ = GreenFuel:GF_BMS_CELL_PAD
CELL14+ = GreenFuel:GF_BMS_CELL_PAD; SPICEPREFIX: X
D1-D9 D11 D16 D20 D21 = ipc-7351-diode:ZENER_
D10 = ipc-7351-diode:DIODE_
D12-D15 = ipc-7351-diode:SCHOTTKY_
FD1-FD6 = adafruit:FIDUCIAL: For use by pick and place machines to calibrate the vision/machine, 1mm By microbuilder.eu
IC1 = GreenFuel:MC33771B: MC33771B - SMARTMOS lithium-ion battery cell controller IC designed for automotive applications, such as hybrid electric (HEV) and electric vehicles (EV) along with industrial applications, such as energy storage systems (ESS) and uninterruptible power supply (UPS) systems. Specification : Type : 64-pin LQFP-EP Manufacture : NXP Manufacture PN: MC33771B-EP Certifications: ISO 26262 Lower limited operating range 7.6 V ≤ VPWR < 9.6 V Supply Voltage : 9.6 V ≤ VPWR ≤ 61.6 V operation, 75 V transient Body Size: 10.00mm x 10.00mm Supporting Material PIC32MX570F512H Datasheet <http://ww1.microchip.com/downloads/en/DeviceDoc/60001290E.pdf>
IC2 IC7 IC8 = optocoupler:SFH6156: 5.3 kV TRIOS High Reliability Optocoupler; MF: VISHAY/TELEFUNKEN; MPN: SFH6156-4T; OC_FARNELL: 1612479; OC_NEWARK: 21H7733
IC3 = GreenFuel:MIC28515
IC9-IC11 = GreenFuel:TLP152-COUPLER
JP1 = adafruit:PINHD-1X1: Pin header 1x1 for 0.1" spacing With round pins
JP3 = GreenFuel:PINOLED: PIN HEADER
JP4-JP6 = GreenFuel:PINHD-1X15: PIN HEADER
JP7 = GreenFuel:PINHD-1X2: PIN HEADER
L1 = GreenFuel:MSS1278
LED1 LED2 = GreenFuel:L-59EGW-CA: T-1 3/4 (5mm) BI-COLOR INDICATOR LAMP Source: http://www.kingbright.com/manager/upload/pdf/L-59EGW-CA%28Ver1292805989.13%29
LED3 LED4 = GreenFuel:SFH482: IR LED infrared emitting diode, Infineon
Q1 = GreenFuel:ZXMP10A17G
Q2 = GreenFuel:BSS138
Q3-Q8 = ipc-7351-transistor:NPN_
R1-R80 R82 R83 R85-R124 = ipc-7351-resistor:RESISTOR_
R81 R84 = GreenFuel:LRMAP3920
S1 = GreenFuel:PGBRD6030
T1-T4 = GreenFuel:IPT020N10N3
U1 U2 = GreenFuel:NCP1117LP